# EAGLE schematic #2 v1 (EAGLE 9.7.0)
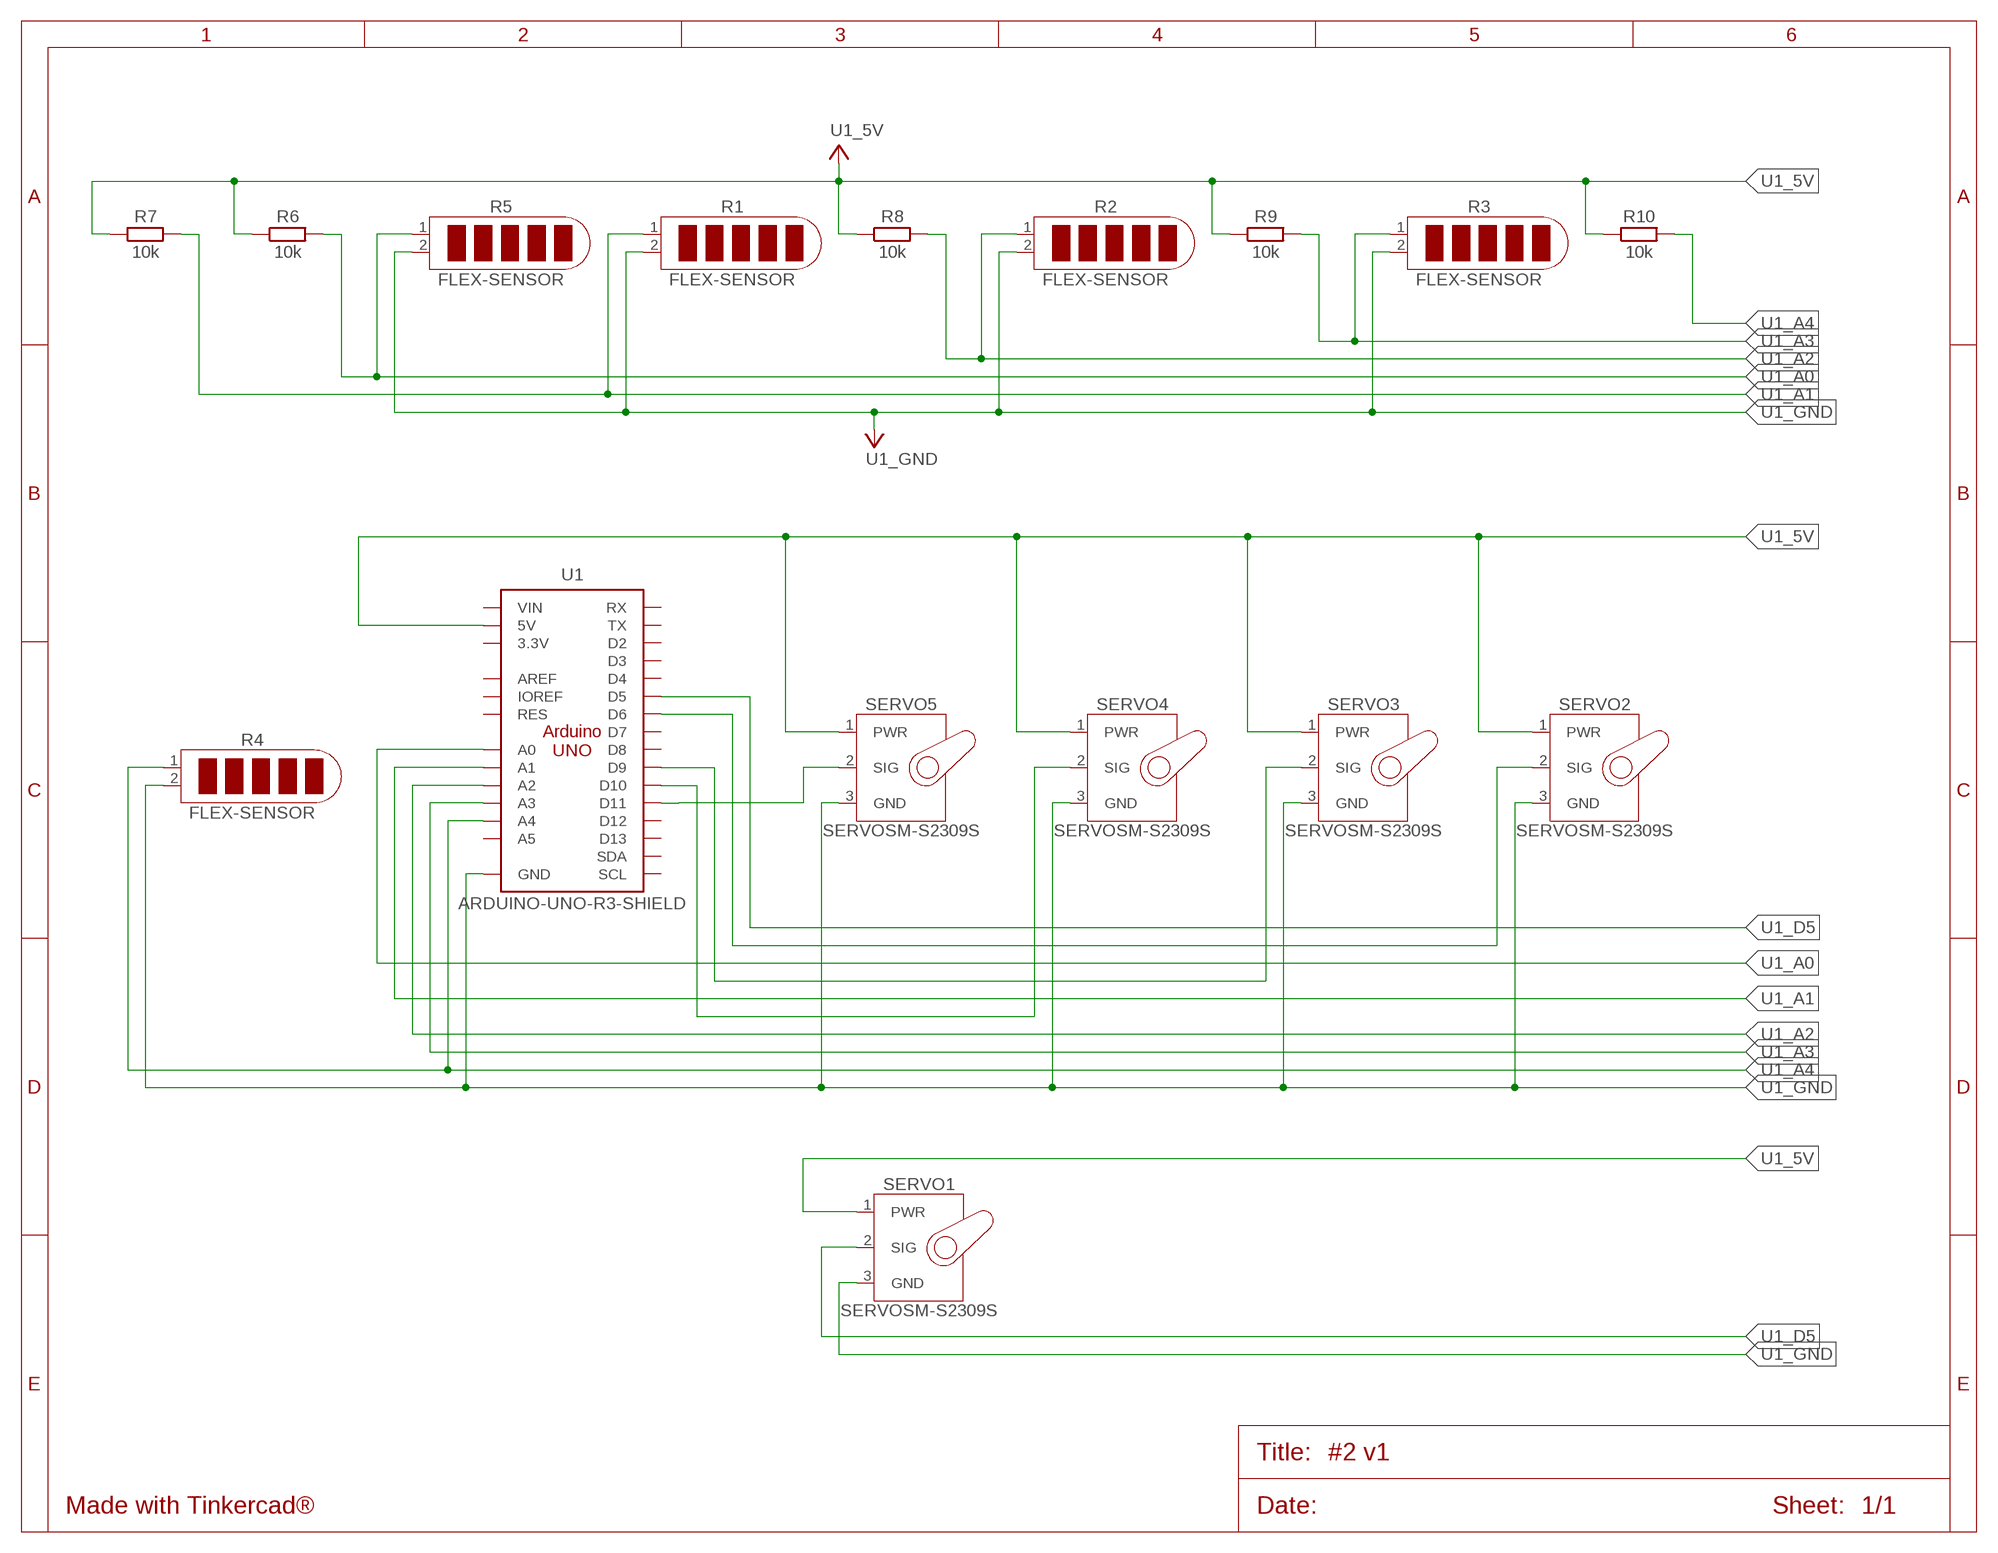
[diagram p0: schematic, sheet 1]

## Parts
R1  FLEX-SENSOR  [1X02]
R2  FLEX-SENSOR  [1X02]
R3  FLEX-SENSOR  [1X02]
R4  FLEX-SENSOR  [1X02]
R5  FLEX-SENSOR  [1X02]
R6  10k  RESISTOR_AXIAL-10.16MM-PITCH  [RESAD1016W63L850D250B]
R7  10k  RESISTOR_AXIAL-10.16MM-PITCH  [RESAD1016W63L850D250B]
R8  10k  RESISTOR_AXIAL-10.16MM-PITCH  [RESAD1016W63L850D250B]
R9  10k  RESISTOR_AXIAL-10.16MM-PITCH  [RESAD1016W63L850D250B]
R10  10k  RESISTOR_AXIAL-10.16MM-PITCH  [RESAD1016W63L850D250B]
SERVO1  SERVOSM-S2309S  [SM-S2309S]
SERVO2  SERVOSM-S2309S  [SM-S2309S]
SERVO3  SERVOSM-S2309S  [SM-S2309S]
SERVO4  SERVOSM-S2309S  [SM-S2309S]
SERVO5  SERVOSM-S2309S  [SM-S2309S]
U1  ARDUINO-UNO-R3-SHIELD  [ARDUINO-UNO-R3-SHIELD]

## Nets
U1_5V: R6.1 R7.1 R8.1 R9.1 R10.1 SERVO1.1(PWR) SERVO2.1(PWR) SERVO3.1(PWR) SERVO4.1(PWR) SERVO5.1(PWR) U1.5V
U1_A0: R5.1 R6.2 U1.A0
U1_A1: R1.1 R7.2 U1.A1
U1_A2: R2.1 R8.2 U1.A2
U1_A3: R3.1 R9.2 U1.A3
U1_A4: R4.1 R10.2 U1.A4
U1_D5: SERVO1.2(SIG) U1.D5
U1_D6: SERVO2.2(SIG) U1.D6
U1_D9: SERVO3.2(SIG) U1.D9
U1_D10: SERVO4.2(SIG) U1.D10
U1_D11: SERVO5.2(SIG) U1.D11
U1_GND: R1.2 R2.2 R3.2 R4.2 R5.2 SERVO1.3(GND) SERVO2.3(GND) SERVO3.3(GND) SERVO4.3(GND) SERVO5.3(GND) U1.GND@0(GND) U1.GND@1(GND) U1.GND@2(GND)
Unconnected: U1.3.3V U1.A5 U1.AREF U1.D2 U1.D3 U1.D4 U1.D7 U1.D8 U1.D12 U1.D13 U1.IOREF U1.RES U1.RX U1.SCL U1.SDA U1.TX U1.VIN

## Library data of the parts
R1-R5 = Tinkercad:FLEX-SENSOR
R6-R10 = Tinkercad:RESISTOR: Resistor Fixed - Generic
SERVO1-SERVO5 = Tinkercad:SERVO
U1 = Tinkercad:ARDUINO-UNO-R3-SHIELD